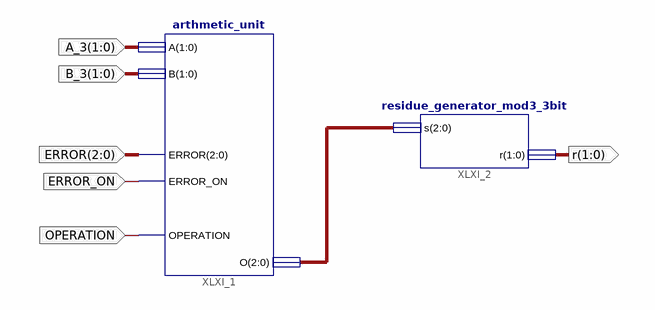
[diagram p0: schematic sheet 1]
// Xilinx ISE schematic arthmetic_unit_mod3.sch (spartan3e) as structural Verilog: 2 symbols, 6 ports
module arthmetic_unit_mod3 (
  input  [1:0] A_3,
  input  [1:0] B_3,
  input  OPERATION,
  input  ERROR_ON,
  input  [2:0] ERROR,
  output [1:0] r
);

  wire [2:0] XLXN_1;

  arthmetic_unit XLXI_1 (.A(A_3), .B(B_3), .OPERATION(OPERATION), .ERROR_ON(ERROR_ON), .ERROR(ERROR), .O(XLXN_1));
  residue_generator_mod3_3bit XLXI_2 (.s(XLXN_1), .r(r));
endmodule
